# Altium schematic sheet microSD.SchDoc
size A4
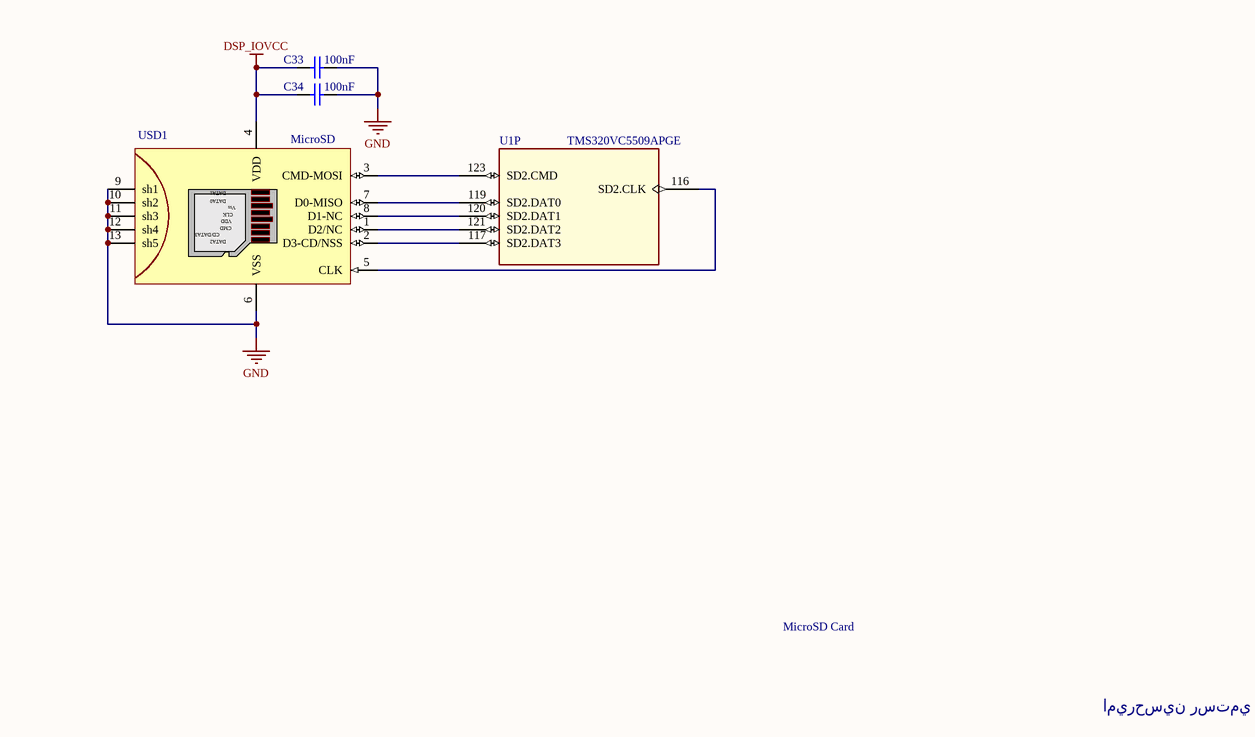
[diagram p0: microSD.SchDoc]

## Parts
C33  100nF  [1608[0603]]
C34  100nF  [1608[0603]]
U1  TMS320VC5509APGE  [TMSVC5509APGA]  (part P of 16)
USD1  MicroSD  [SD_MMC_SOCKET]

## Nets
DSP_IOVCC: C33.2 C34.2 USD1.4(VDD)
GND: C33.1 C34.1 USD1.6(VSS) USD1.9(sh1) USD1.10(sh2) USD1.11(sh3) USD1.12(sh4) USD1.13(sh5)
NetU1_116: U1.116(SD2.CLK) USD1.5(CLK)
NetU1_117: U1.117(SD2.DAT3) USD1.2(D3-CD/NSS)
NetU1_119: U1.119(SD2.DAT0) USD1.7(D0-MISO)
NetU1_120: U1.120(SD2.DAT1) USD1.8(D1-NC)
NetU1_121: U1.121(SD2.DAT2) USD1.1(D2/NC)
NetU1_123: U1.123(SD2.CMD) USD1.3(CMD-MOSI)

## Notes on the sheet
- MicroSD Card
- اميرحسين رستمي
- (in symbol MicroSD) DATA1; DATA0; Vss; CMD; CD/DATA3; DATA2

## Library data of the parts
C33 C34 = Cap Semi: Capacitor; Published: 8-Jun-2000; LatestRevisionDate: 17-Jul-2002; LatestRevisionNote: Re-released for DXP Platform.; PackageReference: C1206; Publisher: Altium Limited; Value: 100nF